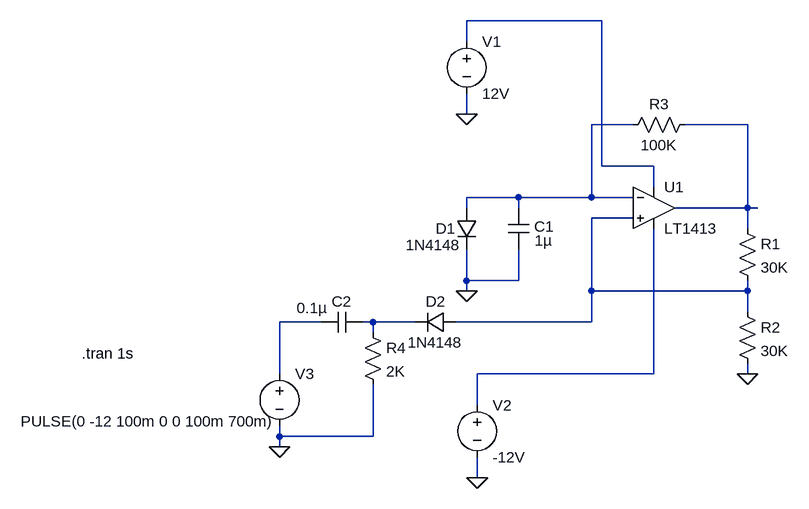
[diagram p0: schematic monostable using opamp.asc]
monostable using opamp.asc, the LTspice schematic file:
Version 4.1
SHEET 1 880 680
WIRE 144 -128 -64 -128
WIRE -64 -96 -64 -128
WIRE -64 16 -64 -16
WIRE 192 32 128 32
WIRE 368 32 272 32
WIRE 144 96 144 -128
WIRE 224 96 144 96
WIRE 224 128 224 96
WIRE 16 144 -64 144
WIRE 128 144 128 32
WIRE 128 144 16 144
WIRE 192 144 128 144
WIRE -64 160 -64 144
WIRE 16 160 16 144
WIRE 368 160 368 32
WIRE 368 160 256 160
WIRE 384 160 368 160
WIRE 192 176 128 176
WIRE 368 192 368 160
WIRE -64 272 -64 224
WIRE 16 272 16 224
WIRE 16 272 -64 272
WIRE -64 288 -64 272
WIRE 128 288 128 176
WIRE 368 288 368 272
WIRE 368 288 128 288
WIRE 368 320 368 288
WIRE -288 336 -352 336
WIRE -208 336 -224 336
WIRE -144 336 -208 336
WIRE 128 336 128 288
WIRE 128 336 -80 336
WIRE -208 352 -208 336
WIRE -352 416 -352 336
WIRE 224 416 224 192
WIRE 224 416 -48 416
WIRE 368 416 368 400
WIRE -48 464 -48 416
WIRE -352 512 -352 496
WIRE -208 512 -208 432
WIRE -208 512 -352 512
WIRE -352 528 -352 512
WIRE -48 576 -48 544
FLAG -64 288 0
FLAG 368 416 0
FLAG -64 16 0
FLAG -48 576 0
FLAG -352 528 0
SYMBOL Opamps\\LT1413 224 96 R0
SYMATTR InstName U1
SYMBOL res 352 176 R0
SYMATTR InstName R1
SYMATTR Value 30K
SYMBOL res 352 304 R0
SYMATTR InstName R2
SYMATTR Value 30K
SYMBOL res 288 16 R90
WINDOW 0 0 56 VBottom 2
WINDOW 3 32 56 VTop 2
SYMATTR InstName R3
SYMATTR Value 100K
SYMBOL cap 0 160 R0
WINDOW 0 40 29 Left 2
WINDOW 3 41 50 Left 2
SYMATTR InstName C1
SYMATTR Value 1µ
SYMBOL diode -80 160 R0
WINDOW 0 -32 32 Left 2
WINDOW 3 -78 57 Left 2
SYMATTR InstName D1
SYMATTR Value 1N4148
SYMBOL voltage -64 -112 R0
WINDOW 123 0 0 Left 2
WINDOW 39 0 0 Left 2
SYMATTR InstName V1
SYMATTR Value 12V
SYMBOL voltage -48 448 R0
WINDOW 123 0 0 Left 2
WINDOW 39 0 0 Left 2
SYMATTR InstName V2
SYMATTR Value -12V
SYMBOL voltage -352 400 R0
WINDOW 3 -398 89 Left 2
WINDOW 123 0 0 Left 2
WINDOW 39 0 0 Left 2
SYMATTR Value PULSE(0 -12 100m 0 0 100m 700m)
SYMATTR InstName V3
SYMBOL diode -80 320 R90
WINDOW 0 0 32 VBottom 2
WINDOW 3 32 32 VTop 2
SYMATTR InstName D2
SYMATTR Value 1N4148
SYMBOL cap -224 320 R90
WINDOW 0 0 32 VBottom 2
WINDOW 3 -21 78 VTop 2
SYMATTR InstName C2
SYMATTR Value 0.1µ
SYMBOL res -224 336 R0
SYMATTR InstName R4
SYMATTR Value 2K
TEXT -656 384 Left 2 !.tran 1s

The netlist it stands for:
* monostable using opamp.asc
X§U1 N004 N002 N001 N007 N003 LT1413  ; pins In+ In- V+ V- OUT
R1 N003 N004 30K
R2 N004 0 30K
R3 N003 N002 100K
C1 N002 0 1µ
D1 N002 0 1N4148
V1 N001 0 12V
V2 N007 0 -12V
V3 N005 0 PULSE(0 -12 100m 0 0 100m 700m)
D2 N004 N006 1N4148
C2 N006 N005 0.1µ
R4 N006 0 2K
.model D D
.lib standard.dio
.tran 1s
.lib LTC.lib
.backanno
.end